# Altium schematic sheet Compute.SchDoc: Compute Module Interface
size A4; SheetNumber: 6; SheetTotal: 6; ImagePath: X:\solarcar\P15_BPS\P15_BPS\logo.jpg
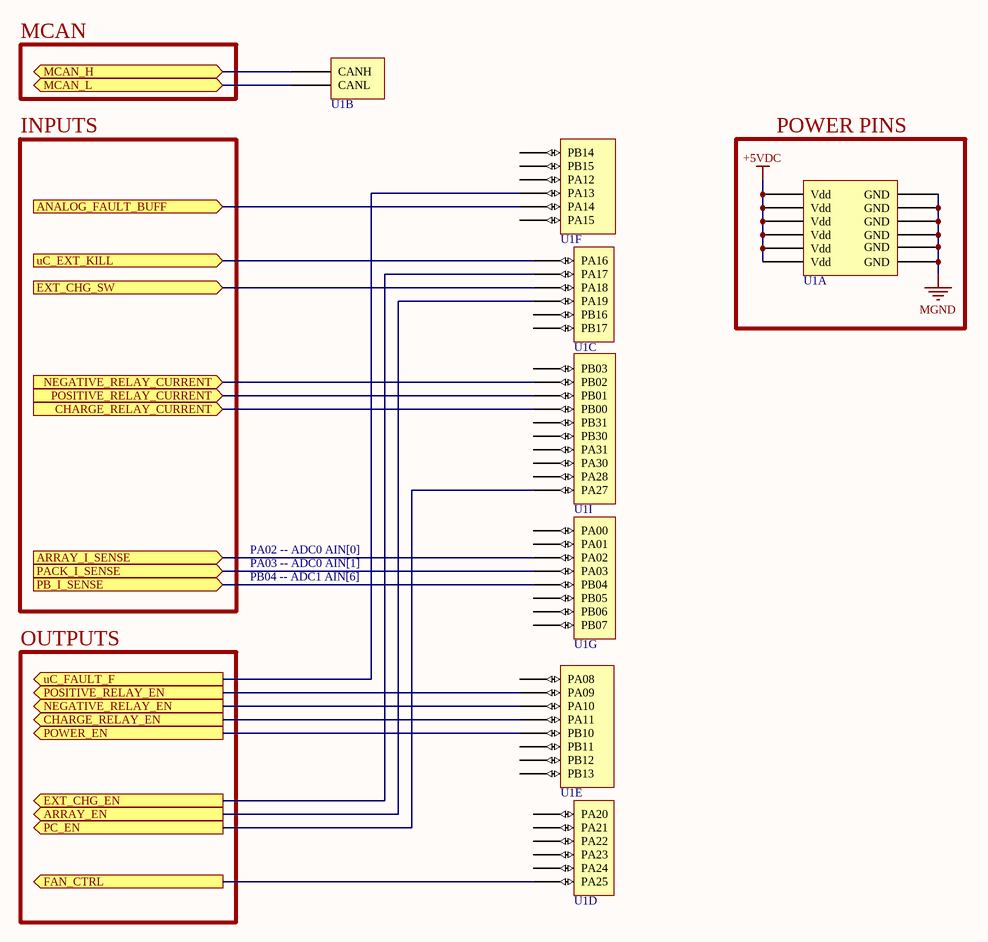
[diagram p0: Compute.SchDoc]

## Parts
U1  S+  [Compute S+]  (value not drawn)  (parts A,B,C,D,E,F,G,I of 9)

## Blocks framed on the sheet
POWER PINS: U1

## Ports
ANALOG_FAULT_BUFF (in), ARRAY_EN (out), ARRAY_I_SENSE (in), CHARGE_RELAY_CURRENT (in), CHARGE_RELAY_EN (out), EXT_CHG_EN (out), EXT_CHG_SW (in), FAN_CTRL (out), MCAN_H (bidir), MCAN_L (bidir), NEGATIVE_RELAY_CURRENT (in), NEGATIVE_RELAY_EN (out), PACK_I_SENSE (in), PB_I_SENSE (in), PC_EN (out), POSITIVE_RELAY_CURRENT (in), POSITIVE_RELAY_EN (out), POWER_EN (out), uC_EXT_KILL (in), uC_FAULT_F (out)

## Nets
+5VDC: U1.Vdd
MGND: U1.GND
ANALOG_FAULT_BUFF: U1.PA14 ; port ANALOG_FAULT_BUFF
ARRAY_EN: U1.PA19 ; port ARRAY_EN
ARRAY_I_SENSE: U1.PA02 ; port ARRAY_I_SENSE
CHARGE_RELAY_CURRENT: U1.PB00 ; port CHARGE_RELAY_CURRENT
CHARGE_RELAY_EN: U1.PA11 ; port CHARGE_RELAY_EN
EXT_CHG_EN: U1.PA17 ; port EXT_CHG_EN
EXT_CHG_SW: U1.PA18 ; port EXT_CHG_SW
FAN_CTRL: U1.PA25 ; port FAN_CTRL
MCAN_H: U1.CANH ; port MCAN_H
MCAN_L: U1.CANL ; port MCAN_L
NEGATIVE_RELAY_CURRENT: U1.PB02 ; port NEGATIVE_RELAY_CURRENT
NEGATIVE_RELAY_EN: U1.PA10 ; port NEGATIVE_RELAY_EN
PACK_I_SENSE: U1.PA03 ; port PACK_I_SENSE
PB_I_SENSE: U1.PB04 ; port PB_I_SENSE
PC_EN: U1.PA27 ; port PC_EN
POSITIVE_RELAY_CURRENT: U1.PB01 ; port POSITIVE_RELAY_CURRENT
POSITIVE_RELAY_EN: U1.PA09 ; port POSITIVE_RELAY_EN
POWER_EN: U1.PB10 ; port POWER_EN
uC_EXT_KILL: U1.PA16 ; port uC_EXT_KILL
uC_FAULT_F: U1.PA13 ; port uC_FAULT_F

Not connected (* = marked no-connect by the designer): U1 PA00 PA01 PA08 PA12 PA20 PA21 PA22 PA23 PA24 PA28 PA30 PA31 PB03 PB05 PB06 PB07 PB09(PA15) PB11 PB12 PB13 PB14 PB15 PB16 PB17 PB30 PB31

## Notes on the sheet
- MCAN
- INPUTS
- PA02 -- ADC0 AIN[0]
- PA03 -- ADC0 AIN[1]
- PB04 -- ADC1 AIN[6]
- OUTPUTS
- Title
- Size:
- Date:
- A4
- Number:
- Time:
- Revision:
- Sheet
- of
- File:

## Library data of the parts
U1 = S+: Need to get 4 of PPPC161LFBN-RC; Digi-key: https://www.digikey.com/product-detail/en/sullins-connector-solutions/PPPC161LFBN-RC/S7049-ND/810188; datasheet: https://media.digikey.com/pdf/Data%20Sheets/Sullins%20PDFs/Female_Headers.100_DS.pdf